# Altium schematic sheet P26_EXPORT.SchDoc
size A3
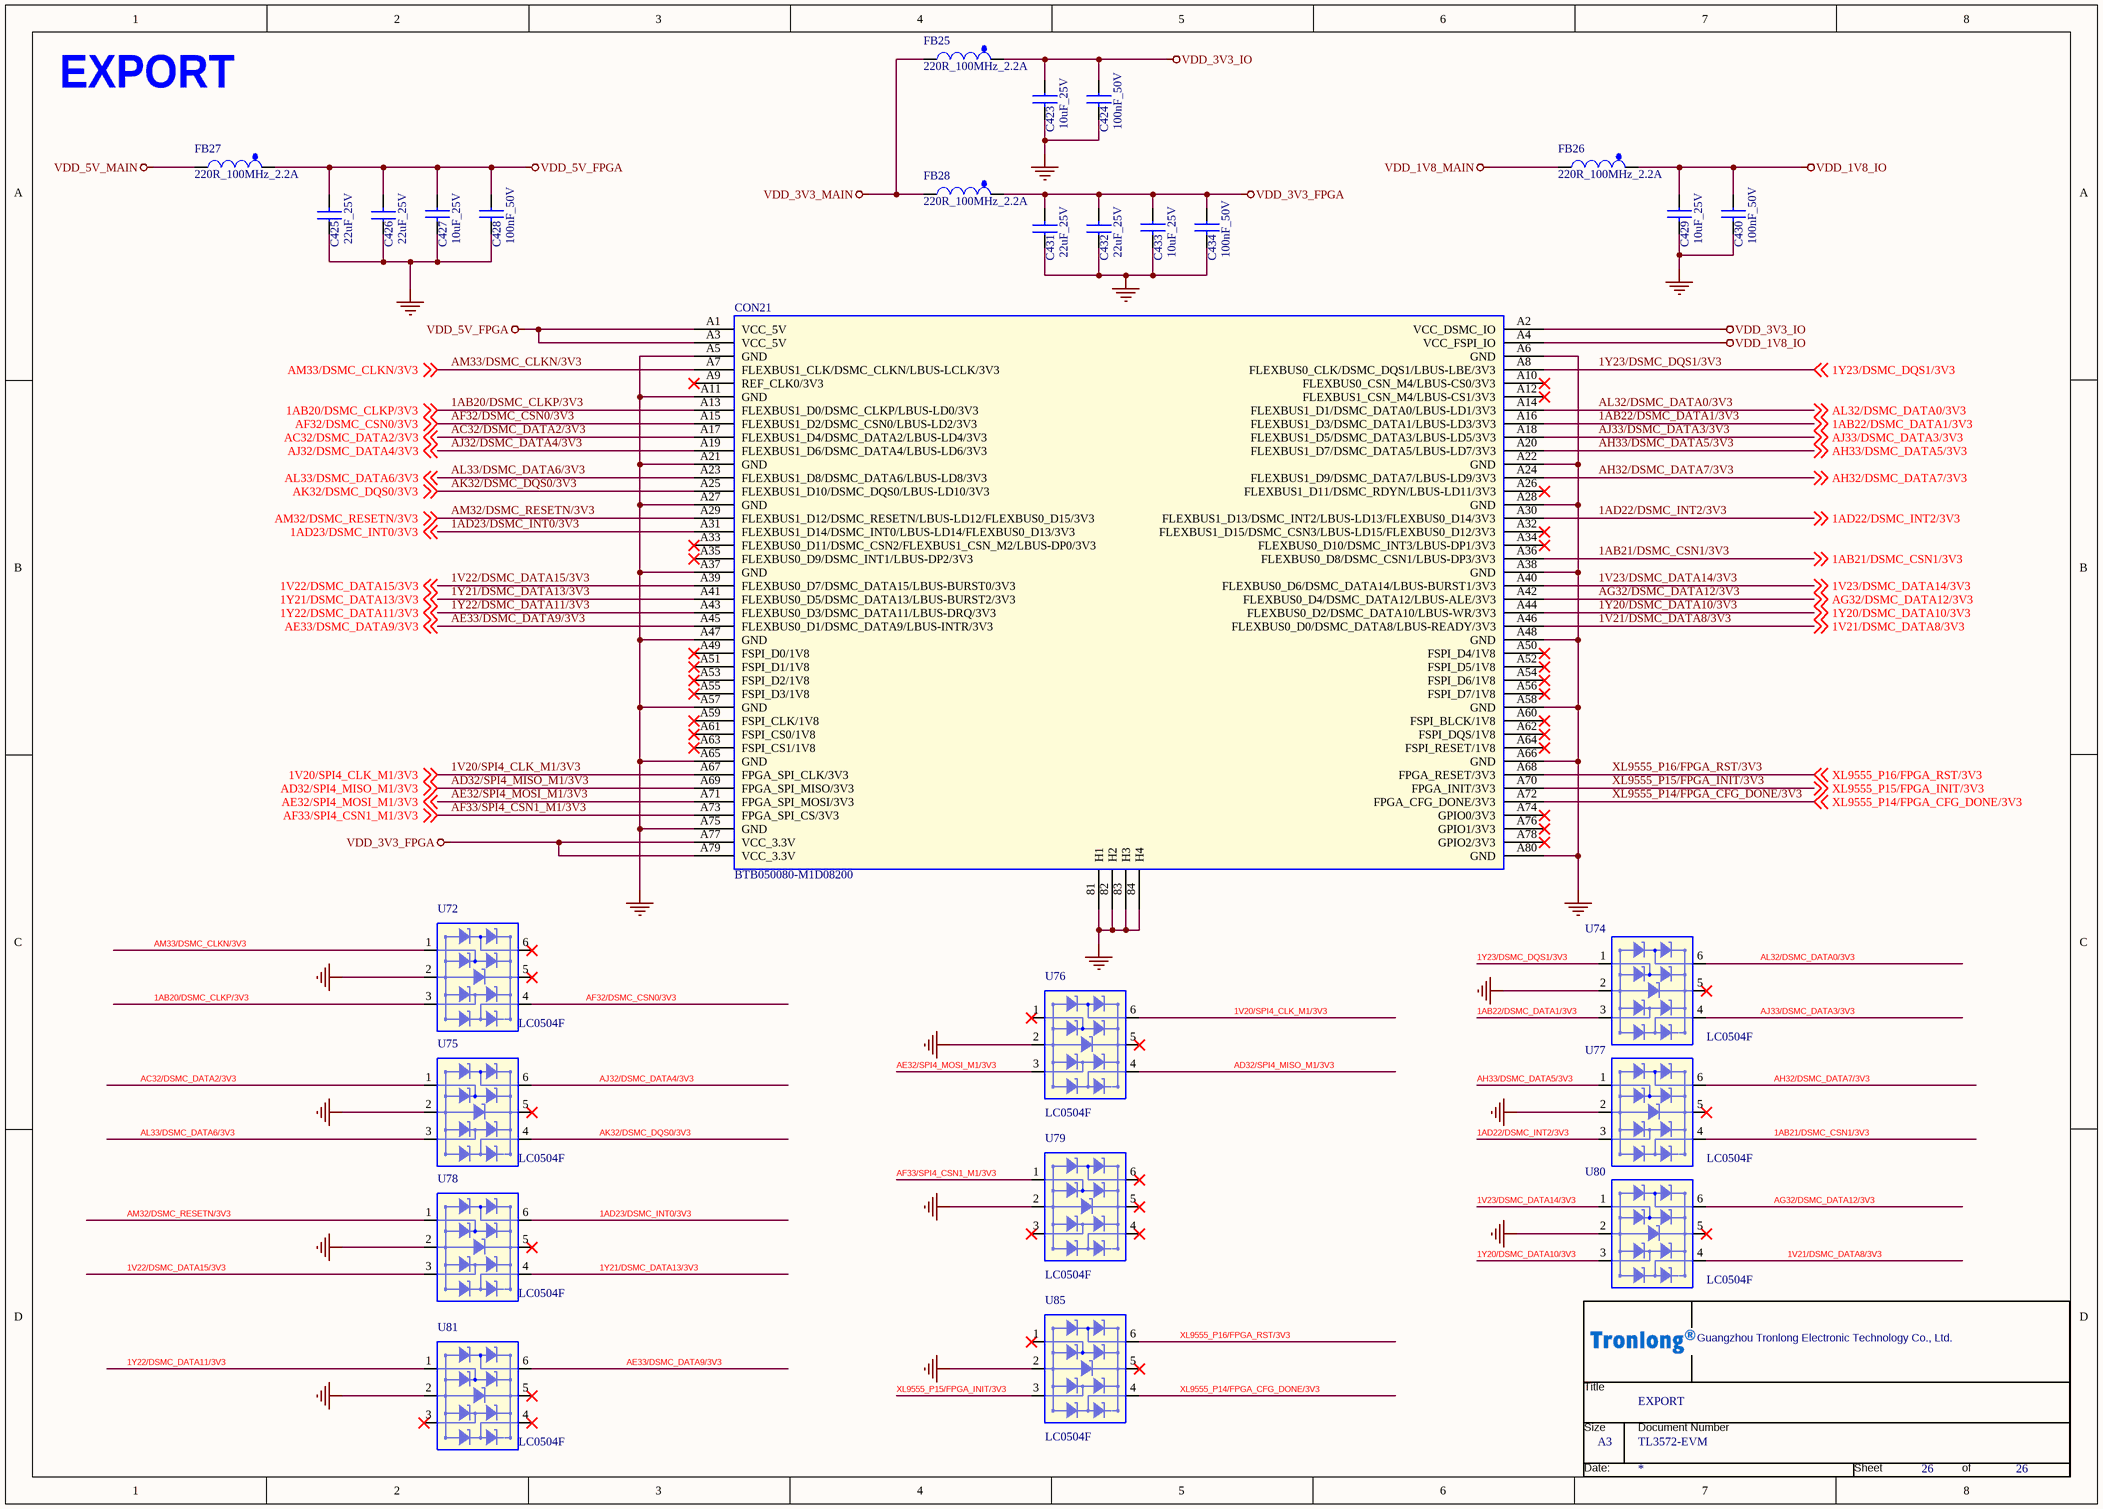
[diagram p0: P26_EXPORT.SchDoc]

## Parts
*  Page Count: 26  Page Size: A3  OrgName: Guangzhou Tronlong Electronic Technology Co., Ltd.  Title: EXPORT  Doc: TL3572-EVM  (hidden comment: TL_NEW)  (graphical)
C423  10uF_25V  [C0603]
C424  100nF_50V  [C0402]
C425  22uF_25V  [C0805]
C426  22uF_25V  [C0805]
C427  10uF_25V  [C0603]
C428  100nF_50V  [C0402]
C429  10uF_25V  [C0603]
C430  100nF_50V  [C0402]
C431  22uF_25V  [C0805]
C432  22uF_25V  [C0805]
C433  10uF_25V  [C0603]
C434  100nF_50V  [C0402]
CON21  BTB050080-M1D08200  [TL-AD-PGL25G]
FB25  220R_100MHz_2.2A  [L0603]
FB26  220R_100MHz_2.2A  [L0603]
FB27  220R_100MHz_2.2A  [L0603]
FB28  220R_100MHz_2.2A  [L0603]
U72  LC0504F  [SOT363]
U74  LC0504F  [SOT363]
U75  LC0504F  [SOT363]
U76  LC0504F  [SOT363]
U77  LC0504F  [SOT363]
U78  LC0504F  [SOT363]
U79  LC0504F  [SOT363]
U80  LC0504F  [SOT363]
U81  LC0504F  [SOT363]
U85  LC0504F  [SOT363]

## Nets
GND: C423.2 C424.2 C425.1 C426.1 C427.2 C428.2 C429.2 C430.2 C431.1 C432.1 C433.2 C434.2 CON21.81(H1) CON21.82(H2) CON21.83(H3) CON21.84(H4) CON21.A5(GND) CON21.A6(GND) CON21.A11(GND) CON21.A21(GND) CON21.A22(GND) CON21.A27(GND) CON21.A28(GND) CON21.A37(GND) CON21.A38(GND) CON21.A47(GND) CON21.A48(GND) CON21.A57(GND) CON21.A58(GND) CON21.A65(GND) CON21.A66(GND) CON21.A75(GND) CON21.A80(GND) U72.2 U74.2 U75.2 U76.2 U77.2 U78.2 U79.2 U80.2 U81.2 U85.2
VDD_1V8_IO: C429.1 C430.1 CON21.A4(VCC_FSPI_IO) FB26.1
VDD_1V8_MAIN: FB26.2
VDD_3V3_FPGA: C431.2 C432.2 C433.1 C434.1 CON21.A77(VCC_3.3V) CON21.A79(VCC_3.3V) FB28.1
VDD_3V3_IO: C423.1 C424.1 CON21.A2(VCC_DSMC_IO) FB25.1
VDD_3V3_MAIN: FB25.2 FB28.2
VDD_5V_FPGA: C425.2 C426.2 C427.1 C428.1 CON21.A1(VCC_5V) CON21.A3(VCC_5V) FB27.1
VDD_5V_MAIN: FB27.2
1AB20/DSMC_CLKP/3V3: CON21.A13(FLEXBUS1_D0/DSMC_CLKP/LBUS-LD0/3V3) U72.3 ; off-sheet 1AB20/DSMC_CLKP/3V3
1AB21/DSMC_CSN1/3V3: CON21.A36(FLEXBUS0_D8/DSMC_CSN1/LBUS-DP3/3V3) U77.4 ; off-sheet 1AB21/DSMC_CSN1/3V3
1AB22/DSMC_DATA1/3V3: CON21.A16(FLEXBUS1_D3/DSMC_DATA1/LBUS-LD3/3V3) U74.3 ; off-sheet 1AB22/DSMC_DATA1/3V3
1AD22/DSMC_INT2/3V3: CON21.A30(FLEXBUS1_D13/DSMC_INT2/LBUS-LD13/FLEXBUS0_D14/3V3) U77.3 ; off-sheet 1AD22/DSMC_INT2/3V3
1AD23/DSMC_INT0/3V3: CON21.A31(FLEXBUS1_D14/DSMC_INT0/LBUS-LD14/FLEXBUS0_D13/3V3) U78.6 ; off-sheet 1AD23/DSMC_INT0/3V3
1V20/SPI4_CLK_M1/3V3: CON21.A67(FPGA_SPI_CLK/3V3) U76.6 ; off-sheet 1V20/SPI4_CLK_M1/3V3
1V21/DSMC_DATA8/3V3: CON21.A46(FLEXBUS0_D0/DSMC_DATA8/LBUS-READY/3V3) U80.4 ; off-sheet 1V21/DSMC_DATA8/3V3
1V22/DSMC_DATA15/3V3: CON21.A39(FLEXBUS0_D7/DSMC_DATA15/LBUS-BURST0/3V3) U78.3 ; off-sheet 1V22/DSMC_DATA15/3V3
1V23/DSMC_DATA14/3V3: CON21.A40(FLEXBUS0_D6/DSMC_DATA14/LBUS-BURST1/3V3) U80.1 ; off-sheet 1V23/DSMC_DATA14/3V3
1Y20/DSMC_DATA10/3V3: CON21.A44(FLEXBUS0_D2/DSMC_DATA10/LBUS-WR/3V3) U80.3 ; off-sheet 1Y20/DSMC_DATA10/3V3
1Y21/DSMC_DATA13/3V3: CON21.A41(FLEXBUS0_D5/DSMC_DATA13/LBUS-BURST2/3V3) U78.4 ; off-sheet 1Y21/DSMC_DATA13/3V3
1Y22/DSMC_DATA11/3V3: CON21.A43(FLEXBUS0_D3/DSMC_DATA11/LBUS-DRQ/3V3) U81.1 ; off-sheet 1Y22/DSMC_DATA11/3V3
1Y23/DSMC_DQS1/3V3: CON21.A8(FLEXBUS0_CLK/DSMC_DQS1/LBUS-LBE/3V3) U74.1 ; off-sheet 1Y23/DSMC_DQS1/3V3
AC32/DSMC_DATA2/3V3: CON21.A17(FLEXBUS1_D4/DSMC_DATA2/LBUS-LD4/3V3) U75.1 ; off-sheet AC32/DSMC_DATA2/3V3
AD32/SPI4_MISO_M1/3V3: CON21.A69(FPGA_SPI_MISO/3V3) U76.4 ; off-sheet AD32/SPI4_MISO_M1/3V3
AE32/SPI4_MOSI_M1/3V3: CON21.A71(FPGA_SPI_MOSI/3V3) U76.3 ; off-sheet AE32/SPI4_MOSI_M1/3V3
AE33/DSMC_DATA9/3V3: CON21.A45(FLEXBUS0_D1/DSMC_DATA9/LBUS-INTR/3V3) U81.6 ; off-sheet AE33/DSMC_DATA9/3V3
AF32/DSMC_CSN0/3V3: CON21.A15(FLEXBUS1_D2/DSMC_CSN0/LBUS-LD2/3V3) U72.4 ; off-sheet AF32/DSMC_CSN0/3V3
AF33/SPI4_CSN1_M1/3V3: CON21.A73(FPGA_SPI_CS/3V3) U79.1 ; off-sheet AF33/SPI4_CSN1_M1/3V3
AG32/DSMC_DATA12/3V3: CON21.A42(FLEXBUS0_D4/DSMC_DATA12/LBUS-ALE/3V3) U80.6 ; off-sheet AG32/DSMC_DATA12/3V3
AH32/DSMC_DATA7/3V3: CON21.A24(FLEXBUS1_D9/DSMC_DATA7/LBUS-LD9/3V3) U77.6 ; off-sheet AH32/DSMC_DATA7/3V3
AH33/DSMC_DATA5/3V3: CON21.A20(FLEXBUS1_D7/DSMC_DATA5/LBUS-LD7/3V3) U77.1 ; off-sheet AH33/DSMC_DATA5/3V3
AJ32/DSMC_DATA4/3V3: CON21.A19(FLEXBUS1_D6/DSMC_DATA4/LBUS-LD6/3V3) U75.6 ; off-sheet AJ32/DSMC_DATA4/3V3
AJ33/DSMC_DATA3/3V3: CON21.A18(FLEXBUS1_D5/DSMC_DATA3/LBUS-LD5/3V3) U74.4 ; off-sheet AJ33/DSMC_DATA3/3V3
AK32/DSMC_DQS0/3V3: CON21.A25(FLEXBUS1_D10/DSMC_DQS0/LBUS-LD10/3V3) U75.4 ; off-sheet AK32/DSMC_DQS0/3V3
AL32/DSMC_DATA0/3V3: CON21.A14(FLEXBUS1_D1/DSMC_DATA0/LBUS-LD1/3V3) U74.6 ; off-sheet AL32/DSMC_DATA0/3V3
AL33/DSMC_DATA6/3V3: CON21.A23(FLEXBUS1_D8/DSMC_DATA6/LBUS-LD8/3V3) U75.3 ; off-sheet AL33/DSMC_DATA6/3V3
AM32/DSMC_RESETN/3V3: CON21.A29(FLEXBUS1_D12/DSMC_RESETN/LBUS-LD12/FLEXBUS0_D15/3V3) U78.1 ; off-sheet AM32/DSMC_RESETN/3V3
AM33/DSMC_CLKN/3V3: CON21.A7(FLEXBUS1_CLK/DSMC_CLKN/LBUS-LCLK/3V3) U72.1 ; off-sheet AM33/DSMC_CLKN/3V3
XL9555_P14/FPGA_CFG_DONE/3V3: CON21.A72(FPGA_CFG_DONE/3V3) U85.4 ; off-sheet XL9555_P14/FPGA_CFG_DONE/3V3
XL9555_P15/FPGA_INIT/3V3: CON21.A70(FPGA_INIT/3V3) U85.3 ; off-sheet XL9555_P15/FPGA_INIT/3V3
XL9555_P16/FPGA_RST/3V3: CON21.A68(FPGA_RESET/3V3) U85.6 ; off-sheet XL9555_P16/FPGA_RST/3V3

Not connected (* = marked no-connect by the designer): CON21 A9(REF_CLK0/3V3)* A10(FLEXBUS0_CSN_M4/LBUS-CS0/3V3)* A12(FLEXBUS1_CSN_M4/LBUS-CS1/3V3)* A26(FLEXBUS1_D11/DSMC_RDYN/LBUS-LD11/3V3)* A32(FLEXBUS1_D15/DSMC_CSN3/LBUS-LD15/FLEXBUS0_D12/3V3)* A33(FLEXBUS0_D11/DSMC_CSN2/FLEXBUS1_CSN_M2/LBUS-DP0/3V3)* A34(FLEXBUS0_D10/DSMC_INT3/LBUS-DP1/3V3)* A35(FLEXBUS0_D9/DSMC_INT1/LBUS-DP2/3V3)* A49(FSPI_D0/1V8)* A50(FSPI_D4/1V8)* A51(FSPI_D1/1V8)* A52(FSPI_D5/1V8)* A53(FSPI_D2/1V8)* A54(FSPI_D6/1V8)* A55(FSPI_D3/1V8)* A56(FSPI_D7/1V8)* A59(FSPI_CLK/1V8)* A60(FSPI_BLCK/1V8)* A61(FSPI_CS0/1V8)* A62(FSPI_DQS/1V8)* A63(FSPI_CS1/1V8)* A64(FSPI_RESET/1V8)* A74(GPIO0/3V3)* A76(GPIO1/3V3)* A78(GPIO2/3V3)*; U72 5* 6*; U74 5*; U75 5*; U76 1* 5*; U77 5*; U78 5*; U79 3* 4* 5* 6*; U80 5*; U81 3* 4* 5*; U85 1* 5*

## Notes on the sheet
- EXPORT
- (in symbol TL_NEW) Title; Size; Document Number; Date:; Sheet; of

## Library data of the parts
* = TL_NEW: RevCode: A?; Page Number: 26; Page Create Date: March  8, 1995; Page Modify Date: *; Document: TL3572-EVM
C423 = CAP NP_Dup2: 贴片陶瓷电容,10uF,20%,25V,X5R; Manufacturer Character: 中国大陆; Manufacturer PartNumber: 0603X106M250NT; Manufacturer: 广东风华高新科技股份有限公司（FH）; Eco-Label: ROHS; ERP Number: 005.0001.0001.00527; As-Welded: /; Operation Temperature（℃）: -55~+85(Ta); PCB Footprint: C0603; Part Status: 优选
C424 C430 = CAP NP_Dup2: 贴片陶瓷电容,100nF,10%,50V,X7R; Manufacturer PartNumber: 0402B104K500NT; Manufacturer Character: 中国大陆; Manufacturer: 广东风华高新科技股份有限公司（FH）; Eco-Label: ROHS; ERP Number: 005.0001.0001.00681; As-Welded: /; Operation Temperature（℃）: -55~+125(Ta); PCB Footprint: C0402; Part Status: 试用
C425 C426 C431 C432 = CAP NP_Dup1: 贴片陶瓷电容,22uF,20%,25V,X5R; Manufacturer PN: C2012X5R1A226K125AB; Manufacturer: 广东风华高新科技股份有限公司（FH）; Manufacturer Character: 中国大陆; Manufacturer PartNumber: 0805X226M250NT; Eco-Label: ROHS; ERP Number: 005.0001.0001.00524; Operation Temperature（℃）: -55~+85(Ta); As-Welded: /; Priority: A; PCB Footprint: C0805; Part Status: 优选; Dielectric: X5R; Part Type: C0805; RK PN: C2012X5R1A226K125AB
C427 C429 C433 = CAP NP_Dup2: 贴片陶瓷电容,10uF,20%,25V,X5R; Manufacturer: 广东风华高新科技股份有限公司（FH）; Manufacturer PartNumber: 0603X106M250NT; Manufacturer Character: 中国大陆; Operation Temperature（℃）: -55~+85(Ta); As-Welded: /; ERP Number: 005.0001.0001.00527; Eco-Label: ROHS; PCB Footprint: C0603; Part Status: 优选
C428 C434 = CAP NP_Dup2: 贴片陶瓷电容,100nF,10%,50V,X7R; Manufacturer: 广东风华高新科技股份有限公司（FH）; Manufacturer Character: 中国大陆; Manufacturer PartNumber: 0402B104K500NT; Eco-Label: ROHS; ERP Number: 005.0001.0001.00681; Operation Temperature（℃）: -55~+125(Ta); As-Welded: /; PCB Footprint: C0402; Part Status: 试用
CON21 = TL-AD-PGL25G_6: B2B连接器,2x40P,0.5mm间距,公座,高度1.0mm,黑色,贴片; Manufacturer Character: 中国大陆; Manufacturer: 深圳市爱特姆科技有限公司（ATOM）; Operation Temperature（℃）: -40~+105(Ta); As-Welded: /; Eco-Label: ROHS; ERP Number: 005.0001.0003.00524; PCB Footprint: TL-AD-PGL25G; Manufacturer PartNumber: BTB050080-M1D08200; Part Status: 优选
FB25 FB28 = FERRITE BEAD_Dup1: 磁珠,50mΩ,2.2A,220R@100MHz; Manufacturer PartNumber: UPZ1608U221-2R2TF; Manufacturer: 深圳顺络电子股份有限公司（Sunlord）; Manufacturer Character: 中国大陆; Eco-Label: ROHS; ERP Number: 005.0001.0007.00015; As-Welded: /; Operation Temperature（℃）: -55~+125(Ta); PCB Footprint: L0603; Temperature: -55~+125(Ta); Part Status: 限选
FB26 FB27 = FERRITE BEAD_Dup1: 磁珠,50mΩ,2.2A,220R@100MHz; Manufacturer Character: 中国大陆; Manufacturer: 深圳顺络电子股份有限公司（Sunlord）; Manufacturer PartNumber: UPZ1608U221-2R2TF; Operation Temperature（℃）: -55~+125(Ta); As-Welded: /; ERP Number: 005.0001.0007.00015; Eco-Label: ROHS; PCB Footprint: L0603; Temperature: -55~+125(Ta); Part Status: 限选
U72 U75-U77 U80 U81 = PRTR5V0U4Y: ESD二极管,VRWM=5V,VBR=6V,四组,单向,8KV,15KV; Manufacturer Character: 中国大陆; Manufacturer: 上海雷卯电子科技有限公司（Leiditech）; room: 8; Operation Temperature（℃）: -55~+125(Tj); As-Welded: /; ERP Number: 005.0001.0017.00061; Eco-Label: ROHS; PCB Footprint: SOT363; Part Status: 优选; Manufacturer PartNumber: LC0504F; Temperature: -55~125℃
U74 = PRTR5V0U4Y: ESD二极管,VRWM=5V,VBR=6V,四组,单向,8KV,15KV; Manufacturer: 上海雷卯电子科技有限公司（Leiditech）; Manufacturer Character: 中国大陆; Eco-Label: ROHS; ERP Number: 005.0001.0017.00061; As-Welded: /; Operation Temperature（℃）: -55~+125(Tj); room: 8; PCB Footprint: SOT363; Temperature: -55~125℃; Manufacturer PartNumber: LC0504F; Part Status: 优选
U78 U85 = PRTR5V0U4Y: ESD二极管,VRWM=5V,VBR=6V,四组,单向,8KV,15KV; Manufacturer: 上海雷卯电子科技有限公司（Leiditech）; Manufacturer Character: 中国大陆; Operation Temperature（℃）: -55~+125(Tj); room: 8; As-Welded: /; ERP Number: 005.0001.0017.00061; Eco-Label: ROHS; PCB Footprint: SOT363; Manufacturer PartNumber: LC0504F; Temperature: -55~125℃; Part Status: 优选
U79 = PRTR5V0U4Y: ESD二极管,VRWM=5V,VBR=6V,四组,单向,8KV,15KV; Manufacturer Character: 中国大陆; Manufacturer: 上海雷卯电子科技有限公司（Leiditech）; Eco-Label: ROHS; ERP Number: 005.0001.0017.00061; As-Welded: /; room: 8; Operation Temperature（℃）: -55~+125(Tj); PCB Footprint: SOT363; Part Status: 优选; Temperature: -55~125℃; Manufacturer PartNumber: LC0504F